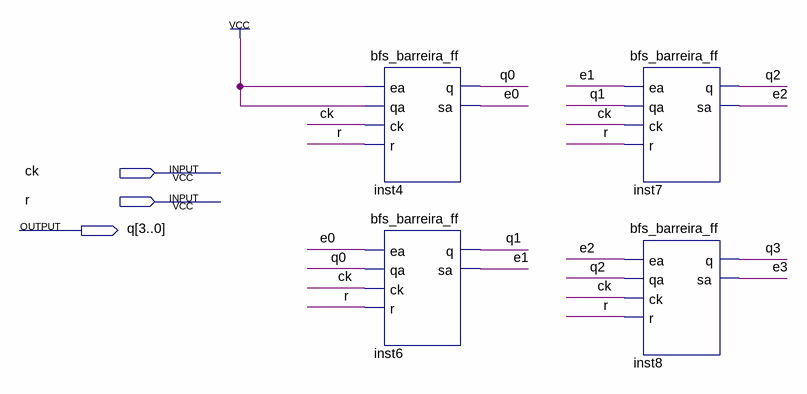
[diagram p0: schematic sheet]
// Quartus schematic bfs_contador_ff.bdf as structural Verilog: 4 symbols, 3 pins
module bfs_contador_ff (
  input  ck,
  input  r,
  output [3:0] q
);

  wire e0, e1, e2, e3;

  bfs_barreira_ff inst4 (.ea(1'b1), .qa(1'b1), .ck(ck), .r(r), .q(q[0]), .sa(e0));
  bfs_barreira_ff inst6 (.ea(e0), .qa(q[0]), .ck(ck), .r(r), .q(q[1]), .sa(e1));
  bfs_barreira_ff inst7 (.ea(e1), .qa(q[1]), .ck(ck), .r(r), .q(q[2]), .sa(e2));
  bfs_barreira_ff inst8 (.ea(e2), .qa(q[2]), .ck(ck), .r(r), .q(q[3]), .sa(e3));
endmodule
